# Altium schematic sheet TGA2237orHMC453.SchDoc: Title
size 420 x 297 mm; CheckedBy: -; CompanyName: CERN; DrawnBy: DrawnBy; Organization: CERN; Address1: European Organization for Nuclear Research; Address2: CH-1211 Genčve 23 - Switzerland; DocumentNumber: 6; Revision: -; SheetNumber: 6; SheetTotal: 10; EDA_Number: EDA-XXXXX-VX-X; Projet: -; ModifiedBy: -; CreateDate: XX/XX/XXXX; CheckedDate: -; Title2: Title2; DivGrp: TE/MPE; Designer: Designer; ModifiedDate: -
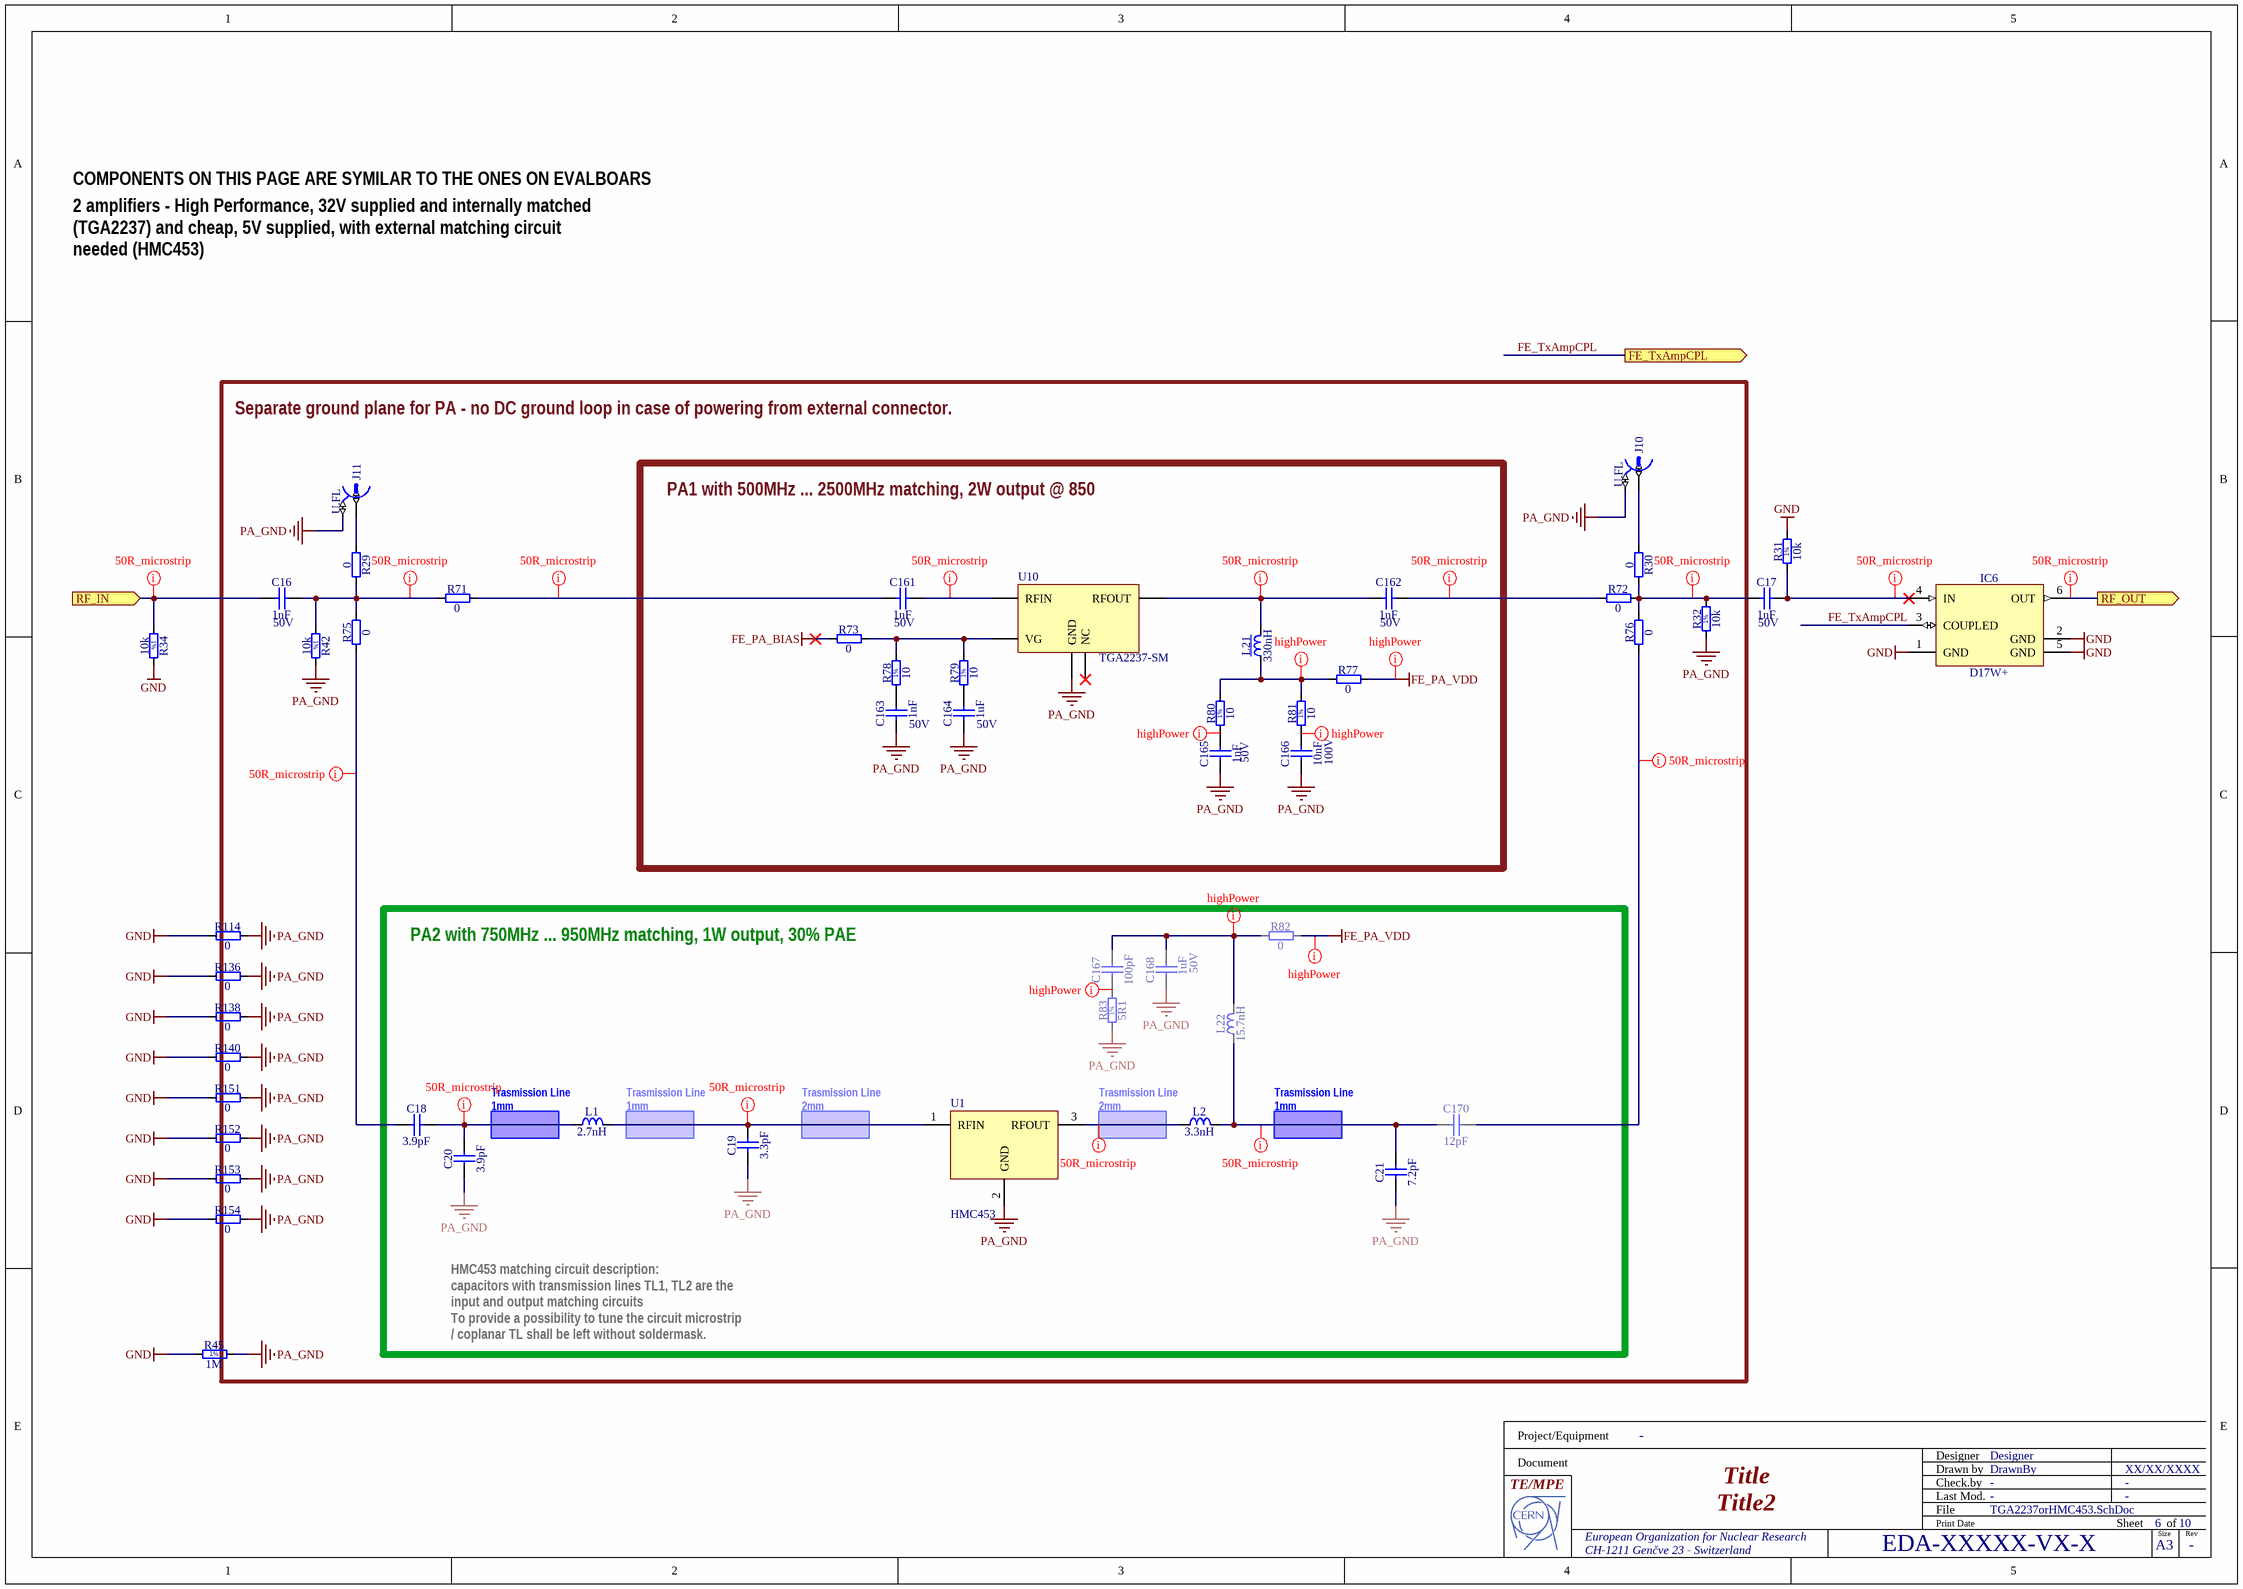
[diagram p0: TGA2237orHMC453.SchDoc]

## Parts
C16  1nF  Voltage: 50V  [CAPC1005X55N]
C17  1nF  Voltage: 50V  [CAPC1005X55N]
C18  3.9pF  [CAPC1005X55N]
C19  3.3pF  [CAPC1005X55N]
C20  3.9pF  [CAPC1005X55N]
C21  7.2pF  [CAPC1005X55N]
C161  1nF  Voltage: 50V  [CAPC1005X55N]
C162  1nF  Voltage: 50V  [CAPC1005X55N]
C163  1nF  Voltage: 50V  [CAPC1005X55N]
C164  1uF  Voltage: 50V  [CAPC2012X110N]
C165  1nF  Voltage: 50V  [CAPC1005X55N]
C166  10nF  Voltage: 100V  [CAPC1608X90N]
C167  100pF  [CAPC1005X55N]
C168  1uF  Voltage: 50V  [CAPC2012X110N]
C170  12pF  [CAPC1005X61N]
IC6  D17W+  [MINI-CIRCUITS_CA531]
J10  U.FL  [HIROSE_U.FL-R-SMT-1(10)]
J11  U.FL  [HIROSE_U.FL-R-SMT-1(10)]
L1  2.7nH  [INDC1005X55N]
L2  3.3nH  [INDC1005X55N]
L21  330nH  [IND_COILCRAFT_0805CS]
L22  15.7nH  [IND_COILCRAFT_0806SQ-16N]
R29  0  [RESC1005X40N]
R30  0  [RESC1005X40N]
R31  10k  [RESC1005X40N]
R32  10k  [RESC1005X40N]
R34  10k  [RESC1005X40N]
R42  10k  [RESC1005X40N]
R45  1M  [RESC1005X40N]
R71  0  [RESC1005X40N]
R72  0  [RESC1005X40N]
R73  0  [RESC1608X55N]
R75  0  [RESC1005X40N]
R76  0  [RESC1005X40N]
R77  0  [RESC1608X55N]
R78  10  [RESC1005X40N]
R79  10  [RESC1005X40N]
R80  10  [RESC1005X40N]
R81  10  [RESC1005X40N]
R82  0  [RESC1608X55N]
R83  5R1  [RESC1005X40N]
R114  0  [RESC1608X55N]
R136  0  [RESC1608X55N]
R138  0  [RESC1608X55N]
R140  0  [RESC1608X55N]
R151  0  [RESC1608X55N]
R152  0  [RESC1608X55N]
R153  0  [RESC1608X55N]
R154  0  [RESC1608X55N]
U1  HMC453  [HMC453]
U10  TGA2237-SM  [TGA2237-SM]

## Ports
FE_TxAmpCPL (out), RF_IN (in), RF_OUT (out)

## Nets
FE_PA_BIAS: R73.1
FE_PA_VDD: R77.2 R82.2
GND: IC6.1(GND) IC6.2(GND) IC6.5(GND) R31.2 R34.2 R45.1 R114.1 R136.1 R138.1 R140.1 R151.1 R152.1 R153.1 R154.1
PA_GND: C19.1 C20.1 C21.1 C163.1 C164.1 C165.1 C166.1 C168.1 J10.2 J11.2 R32.1 R42.2 R45.2 R83.1 R114.2 R136.2 R138.2 R140.2 R151.2 R152.2 R153.2 R154.2 U1.2(GND) U10.1,2,4,6,8,9,16,17,19,21,23,24,25,32(GND)
FE_TxAmpCPL: IC6.3(COUPLED) ; port FE_TxAmpCPL
RF_IN: C16.1 R34.1 ; port RF_IN
RF_OUT: IC6.6(OUT) ; port RF_OUT
NetC16_2: C16.2 R29.2 R42.1 R71.1 R75.2
NetC17_1: C17.1 R30.2 R32.2 R72.2 R76.2
NetC17_2: C17.2 IC6.4(IN) R31.1
NetC18_1: C18.1 R75.1
NetC18_2: C18.2 C20.2 L1.1
NetC19_2: C19.2 L1.2 U1.1(RFIN)
NetC21_2: C21.2 C170.1 L2.2 L22.1
NetC161_1: C161.1 R71.2
NetC161_2: C161.2 U10.5(RFIN)
NetC162_1: C162.1 L21.2 U10.20(RFOUT)
NetC162_2: C162.2 R72.1
NetC163_2: C163.2 R78.1
NetC164_2: C164.2 R79.1
NetC165_2: C165.2 R80.1
NetC166_2: C166.2 R81.1
NetC167_1: C167.1 R83.2
NetC167_2: C167.2 C168.2 L22.2 R82.1
NetC170_2: C170.2 R76.1
NetJ10_1: J10.1 R30.1
NetJ11_1: J11.1 R29.1
NetL2_1: L2.1 U1.3(RFOUT)
NetL21_1: L21.1 R77.1 R80.2 R81.2
NetR73_2: R73.2 R78.2 R79.2 U10.26(VG)

Not connected (* = marked no-connect by the designer): U10 3,7,10,11,12,13,14,15,18,22,27,28,29,30,31(NC)*

## Layout directives
net class 50R_class: NetC16_2, NetC17_1, NetC17_2, NetC18_1, NetC18_2, NetC19_2, NetC21_2, NetC161_1, NetC161_2, NetC162_1, NetC162_2, NetC170_2, NetL2_1, RF_IN, RF_OUT
net class highPower: FE_PA_VDD, NetC165_2, NetC166_2, NetC167_1, NetC167_2, NetL21_1

## Notes on the sheet
- COMPONENTS ON THIS PAGE ARE SYMILAR TO THE ONES ON EVALBOARS
- 2 amplifiers - High Performance, 32V supplied and internally matched (TGA2237) and cheap, 5V supplied, with external matching circuit needed (HMC453)
- Separate ground plane for PA - no DC ground loop in case of powering from external connector.
- PA1 with 500MHz ... 2500MHz matching, 2W output @ 850 ... 2250MHz, 27% PAE @850MHz, 20% PAE @2200MHz
- PA2 with 750MHz ... 950MHz matching, 1W output, 30% PAE
- (near L1) Trasmission Line
  1mm
- Trasmission Line
  1mm
- (near U1) Trasmission Line
  2mm
- (near L2) Trasmission Line
  2mm
- HMC453 matching circuit description:
  capacitors with transmission lines TL1, TL2 are the input and output matching circuits
  To provide a possibility to tune the circuit microstrip / coplanar TL shall be left without soldermask.
- Project/Equipment
- Document
- Designer
- Drawn by
- Check.by
- File
- Last Mod.
- Print Date
- Sheet
- Size
- A3
- of
- Rev
- (in symbol R0402_1M_1%_0.0625W_100PPM) 1%
- (in symbol R0402_5R1_1%_0.0625W_100PPM) 1%
- (in symbol R0402_10K_1%_0.0625W_100PPM) 1%
- (in symbol R0402_10R_1%_0.0625W_200PPM) 1%

## Library data of the parts
C16 C17 C161-C163 C165 = CC0402_1NF_50V_10%_X7R: Non-polarised capacitor; Part Description: SMD Multilayer Chip Ceramic Capacitor; Manufacturer: GENERIC; Manufacturer1 Part Number: 223858715623; TC: X7R; Tolerance: ±10%; Part Number: CC0402_1NF_50V_10%_X7R; Component Kind: Standard; Component Type: Standard; Pin Count: 2; Value: 1nF; Status: Not Recommended; Manufacturer Part Number: CC0402_1NF_50V_10%_X7R; Case: 0402; Mounted: Yes; Socket: No; SMD: Yes; Sense: No; Manufacturer1 Example: PHYCOMP; Manufacturer1 ComponentHeight: 0.55mm; HelpURL: \\cern.ch\dfs\Applications\Altium\Datasheets\CC0402_X7R_PHYCOMP.pdf; Author: CERN DEM JLC; CreateDate: 03.12.2007; LatestRevisionDate: 03.12.2007
C18 = CC0402_3.9pF_50V_10%_NP0: Standard Cap; Part Description: SMD Multilayer Chip Ceramic Capacitor; Manufacturer: Murata; Manufacturer Part Number: GCQ1555C1H3R9WB01D; Voltage: 50V; TC: NP0; Tolerance: ±10%; Part Number: CC0402_3.9pF_50V_10%_NP0; Component Kind: Standard; Component Type: Standard; Pin Count: 2; Value: 3.9pF; Status: Recommended; Case: 0402; Socket: No; SMD: Yes; Sense: No; Author: SHA
C19 = CC0402_3.3PF_50V_0.25PF_C0G: Non-polarised capacitor; Part Description: SMD Multilayer Chip Ceramic Capacitor; Manufacturer: GENERIC; Manufacturer1 Part Number: C0402C339C5GACTU; Voltage: 50V; TC: C0G/NP0; Tolerance: ±0.25pF; Part Number: CC0402_3.3PF_50V_0.25PF_C0G; Component Kind: Standard; Component Type: Standard; Pin Count: 2; Value: 3.3pF; Status: Preferred; Manufacturer Part Number: CC0402_3.3PF_50V_0.25PF_C0G; Case: 0402; Mounted: Yes; Socket: No; SMD: Yes; Sense: No; Manufacturer1 Example: KEMET; Manufacturer1 ComponentHeight: 0.55mm; HelpURL: \\cern.ch\dfs\Applications\Altium\Datasheets\CC0805_C0G_KEMET_(Commercial Grade).pdf; Author: CERN DEM JLC; CreateDate: 03.12.2007; LatestRevisionDate: 22.04.2015
C20 = CC0402_5.6pF_50V_10%_NP0: Standard Cap; Part Number: CC0402_3.9pF_50V_10%_NP0; Part Description: SMD Multilayer Chip Ceramic Capacitor; Manufacturer: Murata; Manufacturer Part Number: GCQ1555C1H3R9WB01D; Voltage: 50V; TC: NP0; Tolerance: ±10%; Component Kind: Standard; Component Type: Standard; Pin Count: 2; Value: 3.9pF; Status: Recommended; Case: 0402; Socket: No; SMD: Yes; Sense: No; Author: SHA
C21 = CC0402_7.2pF_50V_10%_NP0: Standard Cap; Part Description: SMD Multilayer Chip Ceramic Capacitor; Manufacturer: Murata; Manufacturer Part Number: GCQ1555C1H3R9WB01D; Voltage: 50V; TC: NP0; Tolerance: ±10%; Part Number: CC0402_7.2pF_50V_10%_NP0; Component Kind: Standard; Component Type: Standard; Pin Count: 2; Value: 7.2pF; Status: Recommended; Case: 0402; Socket: No; SMD: Yes; Sense: No; Author: SHA
C164 C168 = CC0805_1UF_50V_10%_X7R: Non-polarised capacitor; Part Description: SMD Multilayer Chip Ceramic Capacitor; Manufacturer: GENERIC; Manufacturer1 Part Number: C0805C105K5RACTU; TC: X7R; Tolerance: ±10%; Part Number: CC0805_1UF_50V_10%_X7R; Component Kind: Standard; Component Type: Standard; Pin Count: 2; Value: 1uF; Status: Preferred; Manufacturer Part Number: CC0805_1UF_50V_10%_X7R; Case: 0805; Mounted: Yes; Socket: No; SMD: Yes; Sense: No; Manufacturer1 Example: KEMET; Manufacturer1 ComponentHeight: 1.1mm; HelpURL: \\cern.ch\dfs\Applications\Altium\Datasheets\CC0805_X7R_KEMET.pdf; Author: CERN DEM JLC; CreateDate: 04.12.2013; LatestRevisionDate: 04.12.2013
C166 = CC0603_10NF_100V_10%_X7R_YUDEN_HMK107B7103KAHT: Non-polarised capacitor; Part Description: SMD Multilayer Chip Ceramic Capacitor for Automotive / Industrial Applications; Manufacturer: TAIYO YUDEN; TC: X7R; Tolerance: ±10%; Part Number: CC0603_10NF_100V_10%_X7R_YUDEN_HMK107B7103KAHT; Component Kind: Standard; Component Type: Standard; Pin Count: 2; Value: 10nF; Status: Not Recommended; Manufacturer Part Number: HMK107B7103KAHT; Case: 0603; Mounted: Yes; Socket: No; SMD: Yes; Sense: No; ComponentHeight: 0.9mm; HelpURL: \\cern.ch\dfs\Applications\Altium\Datasheets\CC0603_TAIYO-YUDEN_HMK107B7103KAHT.pdf; Author: CERN DEM JLC; CreateDate: 10.05.2017; LatestRevisionDate: 10.05.2017
C167 = CC0402_100PF_50V_5%_C0G: Non-polarised capacitor; Part Description: SMD Multilayer Chip Ceramic Capacitor; Manufacturer: GENERIC; Manufacturer1 Part Number: C0402C101J5GACTU; Voltage: 50V; TC: C0G/NP0; Tolerance: ±5%; Part Number: CC0402_100PF_50V_5%_C0G; Component Kind: Standard; Component Type: Standard; Pin Count: 2; Value: 100pF; Status: Preferred; Manufacturer Part Number: CC0402_100PF_50V_5%_C0G; Case: 0402; Mounted: Yes; Socket: No; SMD: Yes; Sense: No; Manufacturer1 Example: KEMET; Manufacturer1 ComponentHeight: 0.55mm; HelpURL: \\cern.ch\dfs\Applications\Altium\Datasheets\CC0805_C0G_KEMET_(Commercial Grade).pdf; Author: CERN DEM JLC; CreateDate: 03.12.2007; LatestRevisionDate: 22.04.2015
C170 = CC0402_12PF_50V_1%_NP0_JOHANSON_R07S: Non-polarised capacitor; Part Description: Ultra High-Q SMD Multilayer Capacitor; Manufacturer: JOHANSON TECHNOLOGY; Manufacturer Part Number: 500R07S120FV4T; Voltage: 50V; TC: C0G/NP0; Tolerance: ±1%; Part Number: CC0402_12PF_50V_1%_NP0_JOHANSON_R07S; Component Kind: Standard; Component Type: Standard; Pin Count: 2; Value: 12pF; Status: Not Recommended; Case: 0402; Mounted: Yes; Socket: No; SMD: Yes; Sense: No; ComponentHeight: 0.61mm; HelpURL: \\cern.ch\dfs\Applications\Altium\Datasheets\CC0402_NP0_JOHANSON_R07S.pdf; Author: CERN DEM BC; CreateDate: 20.11.2017; LatestRevisionDate: 26.09.2018
IC6 = D17W+: 50 Ohms, 700 To 3500MHz, 4W, 16-26dB  Directional Coupler; Manufacturer: MINI-CIRCUITS; PressFit: No; Bonding: No; Part Number: D17W+; Component Kind: Standard; Component Type: Standard; Device: D17W+; PackageDescription: MINI-CIRCUITS Case CA531, 0.94mm Pitch, Body 3mm W X 3.1mm L; Part Description: 50 Ohms, 700 To 3500MHz, 4W, 16-26dB  Directional Coupler; Manufacturer Part Number: D17W+; Pin Count: 6; Mounted: Yes; Socket: No; SMD: Yes; Sense: No; ComponentHeight: 1.63mm; Author: CERN DEM MR; HelpURL: \\cern.ch\dfs\Applications\Altium\Datasheets\D17W+.pdf; CreateDate: 05.04.2019; LatestRevisionDate: 05.04.2019
J10 J11 = HIROSE_U.FL-R-SMT-1(10): Part Description: Up to 6GHz Ultra Small Surface Mount Male Coaxial Connectors U.FL Series; Manufacturer: HIROSE (HRS); PressFit: No; Part Number: HIROSE_U.FL-R-SMT-1(10); Component Kind: Standard; Component Type: Standard; Pin Count: 2; Family: U.FL; Mounted: Yes; Socket: No; SMD: Yes; Sense: No; Status: None; Manufacturer Part Number: U.FL-R-SMT-1(10); ComponentHeight: 1.25mm; HelpURL: \\cern.ch\dfs\Applications\Altium\Datasheets\HIROSE_U.FL-R-SMT-1(10).pdf; Author: CERN DEM JLC; CreateDate: 24.03.2010; LatestRevisionDate: 24.03.2010
L1 = Inductor_0402_2.7nH_murata: RF Inductor; Part Number: LQG15HZ2N7S02D; Manufacturer: Murata; Tolerance: ±1%; Component Kind: Standard; Component Type: Standard; Pin Count: 2; Value: 2.7nH; Status: None; Manufacturer Part Number: LQG15HZ2N7S02D; Mounted: Yes; Socket: No; SMD: Yes; Sense: No
L2 = Inductor_0402_3.3nH_murata: RF Inductor; Part Number: LQG15HZ3N3S02D; Manufacturer: Murata; Manufacturer Part Number: LQG15HZ2N7S02D; Tolerance: ±1%; Component Kind: Standard; Component Type: Standard; Pin Count: 2; Value: 3.3nH; Status: None; Mounted: Yes; Socket: No; SMD: Yes; Sense: No
L21 = IND_330NH_2%_COILCRAFT_0805CS: Inductor With Core; Part Description: SMT Chip Inductor; Manufacturer Part Number: 0805CS-331XGL; Power: 310mA; Resistance: 1.4R; Tolerance: ±2%; Part Number: IND_330NH_2%_COILCRAFT_0805CS; Component Kind: Standard; Component Type: Standard; Pin Count: 2; Value: 330nH; Status: None; Manufacturer: COILCRAFT; Case: 0805; Mounted: Yes; Socket: No; SMD: Yes; Sense: No; ComponentHeight: 1.52mm; HelpURL: \\cern.ch\dfs\Applications\Altium\Datasheets\IND_COILCRAFT_0805CS.pdf; Author: CERN DEM JMW; CreateDate: 26.10.2015; LatestRevisionDate: 26.10.2015
L22 = IND_15.7NH_2%_COILCRAFT_0806SQ-16NGLC: Inductor; Part Description: Square Air Core Inductor; Power: 2.9A; Resistance: 0.009R; Tolerance: ±2%; Part Number: IND_15.7NH_2%_COILCRAFT_0806SQ-16NGLC; Component Kind: Standard; Component Type: Standard; Pin Count: 2; Value: 15.7nH; Status: None; Manufacturer: COILCRAFT; Manufacturer Part Number: 0806SQ-16NGLC; Mounted: Yes; Socket: No; SMD: Yes; Sense: No; ComponentHeight: 1.5mm; HelpURL: \\cern.ch\dfs\Applications\Altium\Datasheets\IND_COILCRAFT_0806SQ-16N.pdf; Author: CERN DEM JLC; CreateDate: 21.03.2018; LatestRevisionDate: 21.03.2018
R29 R30 R71 R72 R75 R76 = R0402_0R_JUMPER: Resistor; Part Description: 1A (0.05R Max DC Resistance) Zero Ohm Jumper; Manufacturer: GENERIC; Manufacturer1 Part Number: 232270591001L; PressFit: No; Part Number: R0402_0R_JUMPER; Component Kind: Standard; Component Type: Standard; Pin Count: 2; Value: 0; Status: Not Recommended; Manufacturer Part Number: R0402_0R_JUMPER; Case: 0402; Mounted: Yes; Sense: No; Socket: No; SMD: Yes; Manufacturer1 Example: YAGEO PHYCOMP; Manufacturer1 ComponentHeight: 0.4mm; HelpURL: \\cern.ch\dfs\Applications\Altium\Datasheets\R0402_Phycomp_RC0402.pdf; Author: CERN DEM JLC; CreateDate: 03.12.2007; LatestRevisionDate: 17.10.2012
R31 R32 R34 R42 = R0402_10K_1%_0.0625W_100PPM: Resistor - 1%; Part Description: General Purpose Thick Film Chip Resistor; Manufacturer: GENERIC; Manufacturer1 Part Number: 232270671003L; TC: ±100ppm/°C; PressFit: No; Part Number: R0402_10K_1%_0.0625W_100PPM; Component Kind: Standard; Component Type: Standard; Pin Count: 2; Value: 10k; Status: Not Recommended; Power: 0.0625W; Tolerance: ±1%; Manufacturer Part Number: R0402_10K_1%_0.0625W_100PPM; Case: 0402; Mounted: Yes; Sense: No; Socket: No; SMD: Yes; Manufacturer1 Example: YAGEO PHYCOMP; Manufacturer1 ComponentHeight: 0.4mm; HelpURL: \\cern.ch\dfs\Applications\Altium\Datasheets\R0402_Phycomp_RC0402.pdf; Author: CERN DEM JLC; CreateDate: 03.12.2007; LatestRevisionDate: 17.10.2012
R45 = R0402_1M_1%_0.0625W_100PPM: Resistor - 1%; Part Description: General Purpose Thick Film Chip Resistor; Manufacturer: GENERIC; Manufacturer1 Part Number: 232270671005L; TC: ±100ppm/°C; PressFit: No; Part Number: R0402_1M_1%_0.0625W_100PPM; Component Kind: Standard; Component Type: Standard; Pin Count: 2; Value: 1M; Status: Not Recommended; Power: 0.0625W; Tolerance: ±1%; Manufacturer Part Number: R0402_1M_1%_0.0625W_100PPM; Case: 0402; Mounted: Yes; Sense: No; Socket: No; SMD: Yes; Manufacturer1 Example: YAGEO PHYCOMP; Manufacturer1 ComponentHeight: 0.4mm; HelpURL: \\cern.ch\dfs\Applications\Altium\Datasheets\R0402_Phycomp_RC0402.pdf; Author: CERN DEM JLC; CreateDate: 03.12.2007; LatestRevisionDate: 17.10.2012
R73 R77 R82 R114 R136 R138 R140 R151-R154 = R0603_0R_JUMPER: Resistor; Part Description: 1A (0.05R Max DC Resistance) Zero Ohm Jumper; Manufacturer: GENERIC; Manufacturer1 Part Number: NRC06Z0; PressFit: No; Part Number: R0603_0R_JUMPER; Component Kind: Standard; Component Type: Standard; Pin Count: 2; Value: 0; Status: Preferred; Manufacturer Part Number: R0603_0R_JUMPER; Case: 0603; Mounted: Yes; Sense: No; Socket: No; SMD: Yes; Manufacturer1 Example: NIC COMPONENT; Manufacturer1 ComponentHeight: 0.55mm; HelpURL: \\cern.ch\dfs\Applications\Altium\Datasheets\R0603_NIC_NRC.pdf; Author: CERN DEM JLC; CreateDate: 03.12.2007; LatestRevisionDate: 13.03.2008
R78-R81 = R0402_10R_1%_0.0625W_200PPM: Resistor - 1%; Part Description: General Purpose Thick Film Chip Resistor; Manufacturer: GENERIC; Manufacturer1 Part Number: 232270671009L; TC: ±200ppm/°C; PressFit: No; Part Number: R0402_10R_1%_0.0625W_200PPM; Component Kind: Standard; Component Type: Standard; Pin Count: 2; Value: 10; Status: Not Recommended; Power: 0.0625W; Tolerance: ±1%; Manufacturer Part Number: R0402_10R_1%_0.0625W_200PPM; Case: 0402; Mounted: Yes; Sense: No; Socket: No; SMD: Yes; Manufacturer1 Example: YAGEO PHYCOMP; Manufacturer1 ComponentHeight: 0.4mm; HelpURL: \\cern.ch\dfs\Applications\Altium\Datasheets\R0402_Phycomp_RC0402.pdf; Author: CERN DEM JLC; CreateDate: 24.06.2009; LatestRevisionDate: 17.10.2012
R83 = R0402_5R1_1%_0.0625W_100PPM: Resistor - 1%; Part Description: General Purpose Thick Film Chip Resistor; Manufacturer: GENERIC; Manufacturer1 Part Number: CRCW04025R10FKED; TC: ±100ppm/°C; PressFit: No; Part Number: R0402_5R1_1%_0.0625W_100PPM; Component Kind: Standard; Component Type: Standard; Pin Count: 2; Value: 5R1; Status: Not Recommended; Power: 0.0625W; Tolerance: ±1%; Manufacturer Part Number: R0402_5R1_1%_0.0625W_100PPM; Case: 0402; Mounted: Yes; Sense: No; Socket: No; SMD: Yes; Manufacturer1 Example: VISHAY; Manufacturer1 ComponentHeight: 0.4mm; HelpURL: \\cern.ch\dfs\Applications\Altium\Datasheets\R0402_VISHAY_CRCW e3.pdf; Author: CERN DEM MR; CreateDate: 22.11.2016; LatestRevisionDate: 22.11.2016